# Altium schematic sheet Power.SchDoc
size A4
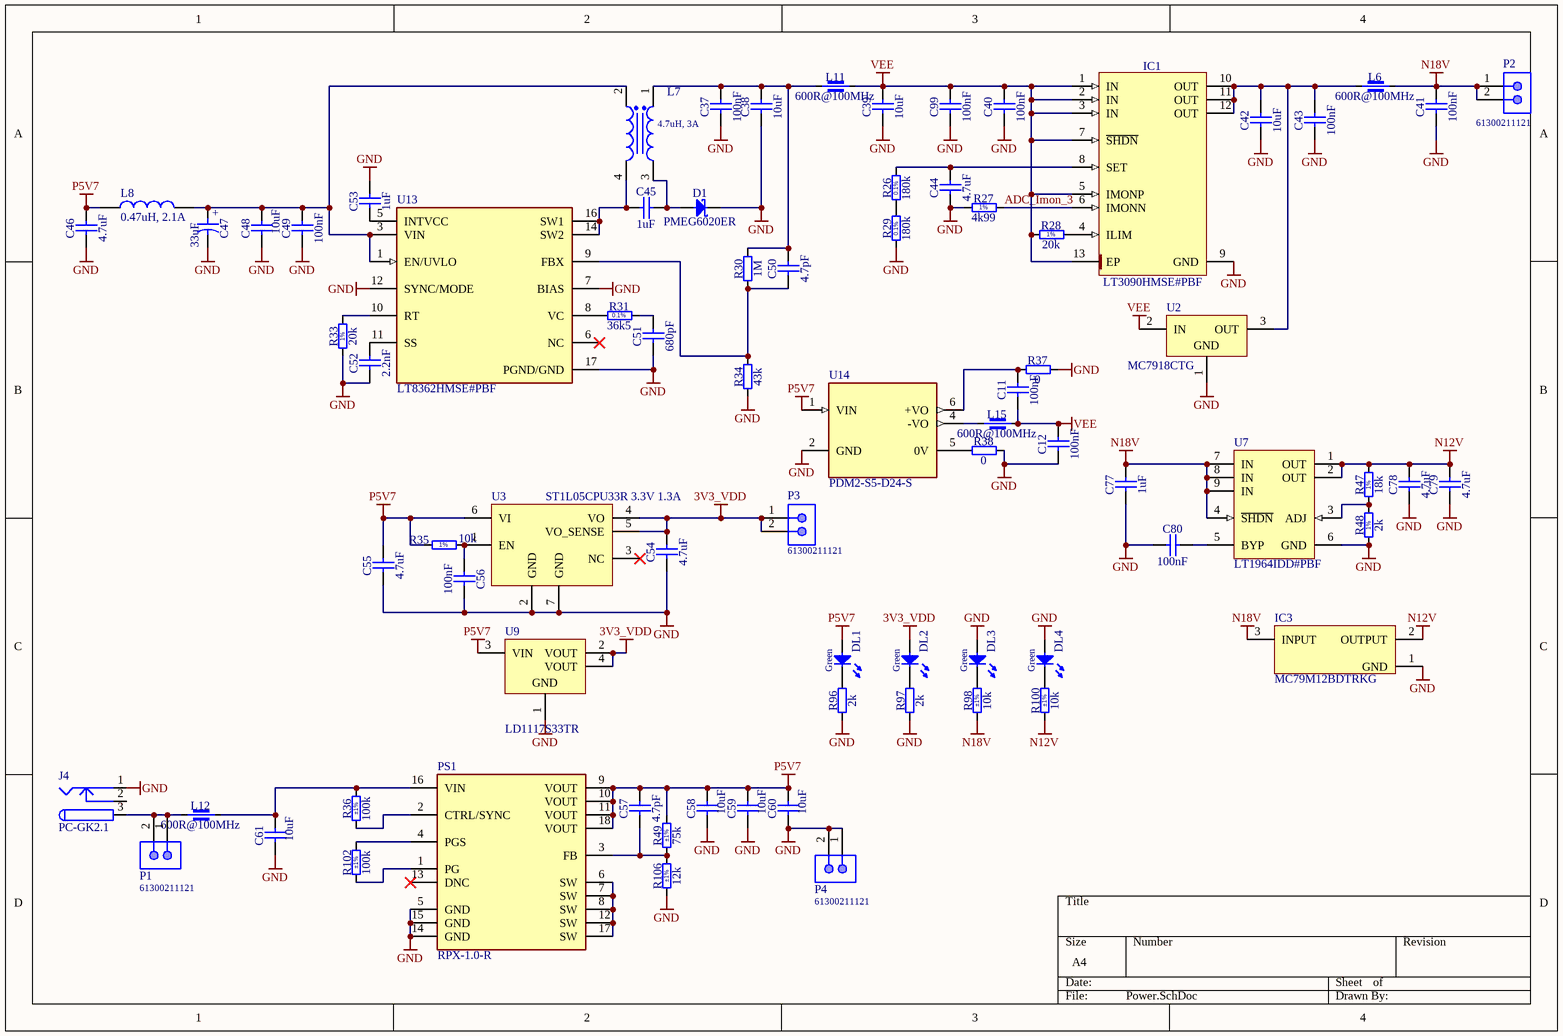
[diagram p0: Power.SchDoc]

## Parts
C11  100nF  [CAPC1005X55N]
C12  100nF  [CAPC1005X55N]
C37  100nF  [CAPC1608X87N]
C38  10uF  [CAPC3216X190N]
C39  10uF  [CAPC3216X190N]
C40  100nF  [CAPC1608X87N]
C41  100nF  [CAPC1608X87N]
C42  10uF  [CAPC3216X190N]
C43  100nF  [CAPC1608X87N]
C44  4.7uF  [CAPC1608X90N]
C45  1uF  [CAPC3216X140N]
C46  4.7uF  [CAPC1608X90N]
C47  33uF  [CAPAE660X540N]
C48  10uF  [CAPC3216X190N]
C49  100nF  [CAPC1608X87N]
C50  4.7pF  [CAPC1005X55N]
C51  680pF  [CAPC1005X55N]
C52  2.2nF  [CAPC1005X55N]
C53  1uF  [CAPC1005X55N]
C54  4.7uF  [CAPC1709X95N]
C55  4.7uF  [CAPC1709X95N]
C56  100nF  [CAPC1005X55N]
C57  4.7pF  [CAPC1005X55N]
C58  10uF  [CAPC3216X190N]
C59  10uF  [CAPC3216X190N]
C60  10uF  [CAPC3216X190N]
C61  10uF  [CAPC3216X190N]
C77  1uF  [CAPC1608X87N]
C78  4.7uF  [CAPC1709X95N]
C79  4.7uF  [CAPC1709X95N]
C80  100nF  [CAPC1005X55N]
C99  100nF  [CAPC1608X87N]
D1  PMEG6020ER  [SODFL3517X110N]
DL1  Green  [LED_OSRAM_LGL29K]
DL2  Green  [LED_OSRAM_LGL29K]
DL3  Green  [LED_OSRAM_LGL29K]
DL4  Green  [LED_OSRAM_LGL29K]
IC1  LT3090HMSE#PBF  [SOP65P490X110-13N-R175X294]
IC3  MC79M12BDTRKG  [TO228P991X239-3N-R546X521]
J4  PC-GK2.1  [DC2020]
L6  600R@100MHz  [INDC2012X110N]
L7  4.7uH, 3A  [WE-DD_1260]
L8  0.47uH, 2.1A  [WE-PMI_0806_H1]
L11  600R@100MHz  [INDC2012X110N]
L12  600R@100MHz  [INDC2012X110N]
L15  600R@100MHz  [INDC2012X110N]
P1  61300211121  [61300211121]
P2  61300211121  [61300211121]
P3  61300211121  [61300211121]
P4  61300211121  [61300211121]
PS1  RPX-1.0-R  [RPX10R]
R26  180k  [RESC3216X65N]
R27  4k99  [RESC1608X55N]
R28  20k  [RESC1005X40N]
R29  180k  [RESC3216X65N]
R30  1M  [RESC1005X40N]
R31  36k5  [RESC1608X55N]
R33  20k  [RESC1005X40N]
R34  43k  [RESC1005X40N]
R35  10k  [RESC1005X40N]
R36  100k  Tolerance: ±1%  [RESC1005X40N]
R37  0  [RESC2012X60N]
R38  0  [RESC2012X60N]
R47  18k  [RESC1005X40N]
R48  2k  [RESC1005X40N]
R49  75k  Tolerance: ±1%  [RESC1005X40N]
R96  2k  [RESC1005X40N]
R97  2k  [RESC1005X40N]
R98  10k  Tolerance: ±1%  [RESC1005X40N]
R100  10k  Tolerance: ±1%  [RESC1005X40N]
R102  100k  Tolerance: ±1%  [RESC1005X40N]
R106  12k  Tolerance: ±1%  [RESC1005X40N]
U2  MC7918CTG  [TO-220]
U3  value ST1L05CPU33R 3.3V 1.3A  [SON95P300X300X80-7N-R160X240]  (hidden comment: ST1L05CPU33R)
U7  LT1964IDD#PBF  [LT-DD-8_V]
U9  LD1117S33TR  [SOT-223_L]
U13  LT8362HMSE#PBF  [FP-MSE-16-05-08-1871-MFG]
U14  PDM2-S5-D24-S  [CONV_PDM2-S5-D24-S]

## Nets
3V3_VDD: C54.2 DL2.2(A) P3.1 P3.2 U3.4(VO) U3.5(VO_SENSE) U9.2(VOUT) U9.4(VOUT)
GND: C12.1 C37.1 C38.1 C39.1 C40.1 C41.1 C42.1 C43.1 C44.1 C46.1 C47.2 C48.1 C49.1 C51.1 C52.1 C53.2 C54.1 C55.1 C56.1 C58.1 C59.1 C60.1 C61.1 C77.1 C78.1 C79.1 C80.1 C99.1 D1.1(C) DL3.2(A) DL4.2(A) IC1.9(GND) IC3.1(GND) J4.1 P4.1 P4.2 PS1.5(GND) PS1.14(GND) PS1.15(GND) R27.1 R29.1 R33.1 R34.1 R37.2 R38.2 R48.1 R96.1 R97.1 R106.1 U2.1(GND) U3.2(GND) U3.7(GND) U7.6(GND) U9.1(GND) U13.7(BIAS) U13.12(SYNC/MODE) U13.17(PGND/GND) U14.2(GND)
N12V: C78.2 C79.2 IC3.2(OUTPUT) R47.2 R100.1 U7.1(OUT) U7.2(OUT)
N18V: C41.2 C77.2 IC3.3(INPUT) L6.2 P2.1 P2.2 R98.1 U7.4(~{SHDN}) U7.7(IN) U7.8(IN) U7.9(IN)
P5V7: C46.2 C55.2 C57.2 C58.2 C59.2 C60.2 DL1.2(A) L8.1 PS1.9(VOUT) PS1.10(VOUT) PS1.11(VOUT) PS1.18(VOUT) R35.1 R49.2 U3.6(VI) U9.3(VIN) U14.1(VIN)
VEE: C11.1 C12.2 C39.2 C40.2 C99.2 IC1.1(IN) IC1.2(IN) IC1.3(IN) IC1.5(IMONP) IC1.7(~{SHDN}) IC1.13(EP) L11.2 L15.2 R28.1 U2.2(IN)
ADC_Imon_3: IC1.6(IMONN) R27.2
NetC11_2: C11.2 R37.1 U14.6(+VO)
NetC37_2: C37.2 C38.2 C50.2 L7.1 L11.1 R30.2
NetC42_2: C42.2 C43.2 IC1.10(OUT) IC1.11(OUT) IC1.12(OUT) L6.1 U2.3(OUT)
NetC44_2: C44.2 IC1.8(SET) R26.2
NetC45_1: C45.1 L7.4 U13.14(SW2) U13.16(SW1)
NetC45_2: C45.2 D1.2(A) L7.3
NetC47_1: C47.1 C48.2 C49.2 L7.2 L8.2 U13.1(EN/UVLO) U13.3(VIN)
NetC50_1: C50.1 R30.1 R34.2 U13.9(FBX)
NetC51_2: C51.2 R31.2
NetC52_2: C52.2 U13.11(SS)
NetC53_1: C53.1 U13.5(INTVCC)
NetC56_2: C56.2 R35.2 U3.1(EN)
NetC57_1: C57.1 PS1.3(FB) R49.1 R106.2
NetC61_2: C61.2 L12.2 PS1.16(VIN) R36.2
NetC80_2: C80.2 U7.5(BYP)
NetDL1_1: DL1.1(C) R96.2
NetDL2_1: DL2.1(C) R97.2
NetDL3_1: DL3.1(C) R98.2
NetDL4_1: DL4.1(C) R100.2
NetIC1_4: IC1.4(ILIM) R28.2
NetJ4_3: J4.3 L12.1 P1.1 P1.2
NetL15_1: L15.1 U14.4(-VO)
NetPS1_1: PS1.1(PG) R102.1
NetPS1_2: PS1.2(CTRL/SYNC) R36.1
NetPS1_4: PS1.4(PGS) R102.2
NetPS1_6: PS1.6(SW) PS1.7(SW) PS1.8(SW) PS1.12(SW) PS1.17(SW)
NetR26_1: R26.1 R29.2
NetR31_1: R31.1 U13.8(VC)
NetR33_2: R33.2 U13.10(RT)
NetR38_1: R38.1 U14.5(0V)
NetR47_1: R47.1 R48.2 U7.3(ADJ)

Not connected (* = marked no-connect by the designer): J4 2; PS1 13(DNC)*; U3 3(NC)*; U13 6(NC)*

## Notes on the sheet
- (in symbol CAE660-540_33UF_35V_20%) +
- (in symbol R0402_2K_1%_0.0625W_100PPM) 1%
- (in symbol R0402_10K_1%_0.0625W_100PPM) 1%
- (in symbol R0402_18K_1%_0.0625W_100PPM) 1%
- (in symbol R0402_20K_1%_0.0625W_100PPM) 1%
- (in symbol R0603_4K99_1%_0.063W_50PPM) 1%
- (in symbol R0603_36K5_0.1%_0.063W_10PPM) 0.1%
- (in symbol R1206_180K_0.1%_0.25W_25PPM) 0.1%

## Library data of the parts
C11 C12 C80 = CC0402_100NF_16V_10%_X7R: Non-polarised capacitor; Part Description: SMD Multilayer Chip Ceramic Capacitor; Manufacturer: GENERIC; Manufacturer1 Part Number: GRM155R71C104KA88D; Voltage: 16V; TC: X7R; Tolerance: ±10%; Part Number: CC0402_100NF_16V_10%_X7R; Component Kind: Standard; Component Type: Standard; Pin Count: 2; Value: 100nF; Status: Not Recommended; Manufacturer Part Number: CC0402_100NF_16V_10%_X7R; Case: 0402; Mounted: Yes; Socket: No; SMD: Yes; Sense: No; Manufacturer1 Example: MURATA; Manufacturer1 ComponentHeight: 0.55mm; HelpURL: \\cern.ch\dfs\Applications\Altium\Datasheets\CC0402_X7R_MURATA_GRM.pdf; Author: CERN DEM JLC; CreateDate: 05.12.2013; LatestRevisionDate: 03.12.2007
C37 C40 C41 C43 C49 C99 = CC0603_100NF_50V_10%_X5R: Non-polarised capacitor; Part Description: SMD Multilayer Chip Ceramic Capacitor; Manufacturer: GENERIC; Manufacturer1 Part Number: C1608X5R1H104K080AA; Voltage: 50V; TC: X5R; Tolerance: ±10%; Part Number: CC0603_100NF_50V_10%_X5R; Component Kind: Standard; Component Type: Standard; Pin Count: 2; Value: 100nF; Status: None; Manufacturer Part Number: CC0603_100NF_50V_10%_X5R; Case: 0603; Mounted: Yes; Socket: No; SMD: Yes; Sense: No; Manufacturer1 Example: TDK; Manufacturer1 ComponentHeight: 0.9mm; HelpURL: \\cern.ch\dfs\Applications\Altium\Datasheets\CC0603_X5R_TDK_C.pdf; Author: CERN DEM MR; CreateDate: 08.01.2016; LatestRevisionDate: 08.01.2016
C38 C39 C42 C48 C58-C61 = CC1206_10UF_35V_10%_X7R_YUDEN_GMJ316BB7106KLHT: Non-polarised capacitor; Part Description: Soft Termination SMD Multilayer Chip Ceramic Capacitor for Automotive / Industrial Applications; Manufacturer: TAIYO YUDEN; Voltage: 35V; TC: X7R; Tolerance: ±10%; Part Number: CC1206_10UF_35V_10%_X7R_YUDEN_GMJ316BB7106KLHT; Component Kind: Standard; Component Type: Standard; Pin Count: 2; Value: 10uF; Status: Not Recommended; Manufacturer Part Number: GMJ316BB7106KLHT; Case: 1206; Mounted: Yes; Socket: No; SMD: Yes; Sense: No; ComponentHeight: 1.90mm; HelpURL: \\cern.ch\dfs\Applications\Altium\Datasheets\CC1206_TAIYO-YUDEN_GMJ316BB7106KLHT.pdf; Author: CERN DEM BC; CreateDate: 26.02.2016; LatestRevisionDate: 17.12.2018
C44 C46 = CC0603_4.7UF_25V_10%_X5R: Non-polarised capacitor; Part Description: SMD Multilayer Chip Ceramic Capacitor; Manufacturer: GENERIC; Manufacturer1 Part Number: GRM188R61E475KE11D; Voltage: 25V; TC: X5R; Tolerance: ±10%; Part Number: CC0603_4.7UF_25V_10%_X5R; Component Kind: Standard; Component Type: Standard; Pin Count: 2; Value: 4.7uF; Status: None; Manufacturer Part Number: CC0603_4.7UF_25V_10%_X5R; Case: 0603; Mounted: Yes; Socket: No; SMD: Yes; Sense: No; Manufacturer1 Example: MURATA; Manufacturer1 ComponentHeight: 0.95mm; HelpURL: \\cern.ch\dfs\Applications\Altium\Datasheets\CC0603_MURATA_GRM188R61E475KE11D.pdf; Author: CERN DEM JLC; CreateDate: 10.11.2014; LatestRevisionDate: 10.11.2014
C45 = CC1206_1UF_100V_10%_X7R: Non-polarised capacitor; Part Description: SMD Multilayer Chip Ceramic Capacitor; Manufacturer: GENERIC; Manufacturer1 Part Number: C1206C105K1RACTU; Voltage: 100V; TC: X7R; Tolerance: ±10%; Part Number: CC1206_1UF_100V_10%_X7R; Component Kind: Standard; Component Type: Standard; Pin Count: 2; Value: 1uF; Status: Preferred; Manufacturer Part Number: CC1206_1UF_100V_10%_X7R; Case: 1206; Mounted: Yes; Socket: No; SMD: Yes; Sense: No; Manufacturer1 Example: KEMET; Manufacturer1 ComponentHeight: 1.8mm; HelpURL: \\cern.ch\dfs\Applications\Altium\Datasheets\CC1206_X7R_KEMET_OPENMODE.pdf; Author: CERN DEM BC; CreateDate: 24.01.2020; LatestRevisionDate: 24.01.2020
C47 = CAE660-540_33UF_35V_20%: Polarised capacitor; Part Description: Aluminum Electrolytic SMT Capacitor; Manufacturer: PANASONIC; Manufacturer Part Number: EEEFK1V330AP; Voltage: 35V; Tolerance: ±20%; Part Number: CAE660-540_33UF_35V_20%; Component Kind: Standard; Component Type: Standard; Pin Count: 2; Value: 33uF; Status: Not Recommended; Case: D; Mounted: Yes; Socket: No; SMD: Yes; Sense: No; ComponentHeight: 5.8mm; HelpURL: \\cern.ch\dfs\Applications\Altium\Datasheets\CAE_PANASONIC_FK.pdf; Author: CERN DEM JLC; CreateDate: 03.12.2007; LatestRevisionDate: 05.11.2014
C50 C57 = CC0402_4.7PF_50V_0.25PF_C0G: Non-polarised capacitor; Part Description: SMD Multilayer Chip Ceramic Capacitor; Manufacturer: GENERIC; Manufacturer1 Part Number: C0402C479C5GACTU; Voltage: 50V; TC: C0G/NP0; Tolerance: ±0.25pF; Part Number: CC0402_4.7PF_50V_0.25PF_C0G; Component Kind: Standard; Component Type: Standard; Pin Count: 2; Value: 4.7pF; Status: Preferred; Manufacturer Part Number: CC0402_4.7PF_50V_0.25PF_C0G; Case: 0402; Mounted: Yes; Socket: No; SMD: Yes; Sense: No; Manufacturer1 Example: KEMET; Manufacturer1 ComponentHeight: 0.55mm; HelpURL: \\cern.ch\dfs\Applications\Altium\Datasheets\CC0402_C0G_KEMET_(Commercial Grade).pdf; Author: CERN DEM JLC; CreateDate: 03.12.2007; LatestRevisionDate: 22.04.2015
C51 = CC0402_680PF_50V_5%_X7R: Non-polarised capacitor; Part Description: SMD Multilayer Chip Ceramic Capacitor; Manufacturer: GENERIC; Manufacturer Part Number: CC0402_680PF_50V_10%_X7R; Manufacturer1 Part Number: 223858715621; Voltage: 50V; TC: X7R; Tolerance: ±10%; Part Number: CC0402_680PF_50V_5%_X7R; Component Kind: Standard; Component Type: Standard; Pin Count: 2; Value: 680pF; Status: Not Recommended; Case: 0402; Mounted: Yes; Socket: No; SMD: Yes; Sense: No; Manufacturer1 Example: PHYCOMP; Manufacturer1 ComponentHeight: 0.55mm; HelpURL: \\cern.ch\dfs\Applications\Altium\Datasheets\CC0402_NP0_PHYCOMP.pdf; Author: CERN DEM JLC; CreateDate: 03.12.2007; LatestRevisionDate: 03.12.2007
C52 = CC0402_2.2NF_50V_10%_X7R: Non-polarised capacitor; Part Description: SMD Multilayer Chip Ceramic Capacitor; Manufacturer: GENERIC; Manufacturer1 Part Number: 223858715627; Voltage: 50V; TC: X7R; Tolerance: ±10%; Part Number: CC0402_2.2NF_50V_10%_X7R; Component Kind: Standard; Component Type: Standard; Pin Count: 2; Value: 2.2nF; Status: Not Recommended; Manufacturer Part Number: CC0402_2.2NF_50V_10%_X7R; Case: 0402; Mounted: Yes; Socket: No; SMD: Yes; Sense: No; Manufacturer1 Example: PHYCOMP; Manufacturer1 ComponentHeight: 0.55mm; HelpURL: \\cern.ch\dfs\Applications\Altium\Datasheets\CC0402_X7R_PHYCOMP.pdf; Author: CERN DEM JLC; CreateDate: 03.12.2007; LatestRevisionDate: 03.12.2007
C53 = CC0402_1UF_16V_10%_X5R: Non-polarised capacitor; Part Description: SMD Multilayer Chip Ceramic Capacitor; Manufacturer: GENERIC; Manufacturer1 Part Number: C1005X5R1C105KT; Voltage: 16V; TC: X5R; Tolerance: ±10%; Part Number: CC0402_1UF_16V_10%_X5R; Component Kind: Standard; Component Type: Standard; Pin Count: 2; Value: 1uF; Status: Preferred; Manufacturer Part Number: CC0402_1UF_16V_10%_X5R; Case: 0402; Mounted: Yes; Socket: No; SMD: Yes; Sense: No; Manufacturer1 Example: TDK; Manufacturer1 ComponentHeight: 0.55mm; HelpURL: \\cern.ch\dfs\Applications\Altium\Datasheets\CC0402_X5R_TDK_C.pdf; Author: CERN DEM JLC; CreateDate: 25.10.2012; LatestRevisionDate: 25.10.2012
C54 C55 C78 C79 = CC0603_4.7UF_16V_10%_X5R: Non-polarised capacitor; Part Description: SMD Multilayer Chip Ceramic Capacitor; Manufacturer: GENERIC; Manufacturer1 Part Number: EMK107ABJ475KA-T; Voltage: 16V; TC: X5R; Tolerance: ±10%; Part Number: CC0603_4.7UF_16V_10%_X5R; Component Kind: Standard; Component Type: Standard; Pin Count: 2; Value: 4.7uF; Status: None; Manufacturer Part Number: CC0603_4.7UF_16V_10%_X5R; Case: 0603; Mounted: Yes; Socket: No; SMD: Yes; Sense: No; Manufacturer1 Example: TAIYO YUDEN; Manufacturer1 ComponentHeight: 0.95mm; HelpURL: \\cern.ch\dfs\Applications\Altium\Datasheets\CC0603_X7R_TAIYO-YUDEN_HIGH-VALUE.pdf; Author: CERN DEM JLC; CreateDate: 16.12.2013; LatestRevisionDate: 16.09.2014
C56 = CC0402_100NF_16V_10%_X5R: Non-polarised capacitor; Part Description: SMD Multilayer Chip Ceramic Capacitor; Manufacturer: GENERIC; Manufacturer1 Part Number: GRM155R61C104KA88D; Voltage: 16V; TC: X5R; Tolerance: ±10%; Part Number: CC0402_100NF_16V_10%_X5R; Component Kind: Standard; Component Type: Standard; Pin Count: 2; Value: 100nF; Status: None; Manufacturer Part Number: CC0402_100NF_16V_10%_X5R; Case: 0402; Mounted: Yes; Socket: No; SMD: Yes; Sense: No; Manufacturer1 Example: MURATA; Manufacturer1 ComponentHeight: 0.55mm; HelpURL: \\cern.ch\dfs\Applications\Altium\Datasheets\CC0402_X5R_MURATA_GRM.pdf; Author: CERN DEM JLC; CreateDate: 10.12.2013; LatestRevisionDate: 10.12.2013
C77 = CC0603_1UF_25V_10%_X7R: Non-polarised capacitor; Part Description: SMD Multilayer Chip Ceramic Capacitor; Manufacturer: GENERIC; Manufacturer1 Part Number: GRM188R71E105KA12D; Voltage: 25V; TC: X7R; Tolerance: ±10%; Part Number: CC0603_1UF_25V_10%_X7R; Component Kind: Standard; Component Type: Standard; Pin Count: 2; Value: 1uF; Status: None; Manufacturer Part Number: CC0603_1UF_25V_10%_X7R; Case: 0603; Mounted: Yes; Socket: No; SMD: Yes; Sense: No; Manufacturer1 Example: MURATA; Manufacturer1 ComponentHeight: 0.9mm; HelpURL: \\cern.ch\dfs\Applications\Altium\Datasheets\CC0603_X7R_MURATA.pdf; Author: CERN DEM JLC; CreateDate: 18.01.2011; LatestRevisionDate: 18.01.2011
D1 = PMEG6020ER: Schottky Diode; Part Description: MEGA Schottky Barrier Rectifier; Manufacturer: NXP SEMICONDUCTORS; Voltage: 60V; Power: 2A; PressFit: No; Bonding: No; Part Number: PMEG6020ER; Component Kind: Standard; Component Type: Standard; Device: PMEG6020ER; PackageDescription: SODFL Diode (SOD123W); 2.60mm W X 1.70mm L X 1.10mm H body, IPC Medium Density; Manufacturer Part Number: PMEG6020ER; Pin Count: 2; Case: SOD123; Mounted: Yes; Socket: No; SMD: Yes; Sense: No; ComponentHeight: 0.65mm; HelpURL: \\cern.ch\dfs\Applications\Altium\Datasheets\PMEG6020ER.pdf; Author: CERN DEM JMW; CreateDate: 19.06.2014; LatestRevisionDate: 19.06.2014
DL1-DL4 = LED_OSRAM_LG L29K-G2J1-24-Z: LED Green 1C 2A; Part Description: Surface Mount Green LED (0603 Case); Manufacturer: OSRAM; PressFit: No; Bonding: No; Status Comment: Sourcing Difficulty; Part Number: LED_OSRAM_LG L29K-G2J1-24-Z; Component Kind: Standard; Component Type: Standard; Color: Green; PackageDescription: Green Chip LED, 2-Leads, Body 1.7x0.8mm, IPC Medium Density; Manufacturer Part Number: LG L29K-G2J1-24-Z; Pin Count: 2; Case: 0603; Mounted: Yes; Socket: No; SMD: Yes; Sense: No; ComponentHeight: 0.67mm; HelpURL: \\cern.ch\dfs\Applications\Altium\Datasheets\LED_OSRAM_LGL29K.pdf; Author: CERN DEM JLC; CreateDate: 24.04.2012; LatestRevisionDate: 24.04.2012; Status: Not Recommended
IC1 = LT3090HMSE#PBF: –36V, 600mA Negative Linear Regulator with Programmable Current Limit; Manufacturer: LINEAR TECHNOLOGY; PressFit: No; Bonding: No; Part Number: LT3090HMSE#PBF; Component Kind: Standard; Component Type: Standard; Device: LT3090HMSE#PBF; PackageDescription: SOP,0.65mm pitch;12 pin,3.00mm W X 4.039mm L X 1.10mm H body, (w/thermal tab 1.75 X 2.94 mm), IPC Medium Density; Part Description: –36V, 600mA Negative Linear Regulator with Programmable Current Limit; Manufacturer Part Number: LT3090HMSE#PBF; Pin Count: 13; Case: MSOP12; Mounted: Yes; Socket: No; SMD: Yes; Sense: No; ComponentHeight: 1.1mm; HelpURL: \\cern.ch\dfs\Applications\Altium\Datasheets\LT3090HMSE#PBF.pdf; Author: CERN DEM JLC; CreateDate: 2015-01-12; LatestRevisionDate: 2015-01-12
J4 = CON_DC_JACK_TH: Low Voltage Power Supply Connector (maritex); Published: 17-Dec-2003; Datasheet: Latest Revision: 09-May-2002; Publisher: Altium Limited; Supplier 1: TME; Supplier Part Number 1: PC-GK2.1
L6 L11 L12 L15 = IND0805_WURTH_742792040: Part Description: SMD EMI Suppression Chip Ferrite Bead (WE-CBF Series); Manufacturer: WURTH ELEKTRONIK; Power: 2A; Resistance: 0.150R; Tolerance: ±25%; Part Number: IND0805_WURTH_742792040; Component Kind: Standard; Component Type: Standard; Pin Count: 2; Value: 600R@100MHz; Status: None; Manufacturer Part Number: 742792040; Case: 0805; Mounted: Yes; Socket: No; SMD: Yes; Sense: No; ComponentHeight: 1.1mm; HelpURL: \\cern.ch\dfs\Applications\Altium\Datasheets\IND0805_WURTH_742792040.pdf; Author: CERN DEM JLC; CreateDate: 10.05.2010; LatestRevisionDate: 25.10.2018
L7 = 744871004: WE-DD SMT Shielded Coupled Inductor, size 1260, 4.7uH, 3A; Manufacturer: Wurth Elektronik; Rated Voltage: 80V; DC Resistance max.: 28mOhm; Self Resonant Frequency: 20MHz; DC Resistance typ.: 23mOhm; Saturation Current: 8A; Turns Ratio: 1:1; Type: Crossed; ComponentLink1Description: Manufacturer; ComponentLink1URL: http://www.we-online.de; ComponentLink2Description: Datasheet; ComponentLink2URL: https://www.we-online.com/catalog/datasheet/744871004.pdf; Packaging: Tape and Reel; Published Date: April 2020; Rated Current: 3A; Operating Temperature: -40 to +125degC; Size: 1260; Inductance: 4.7uH; Mounting Technology: SMT; Manufacturer Part Number: 744871004
L8 = 74479876147: WE-PMI Power Multilayer Inductor, size 0806, 0.47uH, 2.1A; Manufacturer: Wurth Elektronik; Q-Factor: 13; Saturation Current: 2A; DC Resistance max.: 50mOhm; Inductance Tolerance: +/-20%; Rated Current @20K: 1.5A; Self Resonant Frequency: 120MHz; Type: Low RDC & High Saturation Current; ComponentLink1Description: Manufacturer; ComponentLink1URL: http://www.we-online.de; ComponentLink2Description: Datasheet; ComponentLink2URL: https://www.we-online.com/catalog/datasheet/74479876147.pdf; Mounting Technology: SMT; Operating Temperature: -40 to +125degC; Packaging: Tape and Reel; Inductance: 0.47uH; Rated Current @40K: 2.1A; Manufacturer Part Number: 74479876147; Published Date: April 2020; Size: 0806
P1-P4 = 61300211121: WR-PHD Pin Header, THT, pitch 2.54mm, Single Row, Vertical, 2p; Manufacturer: Wurth Elektronik; Pin Number: 2; Rated Current: 3A; Working Voltage: 250VAC; Withstanding Voltage: 500VAC; Contact Resistance: 20mOhm; ComponentLink1Description: Manufacturer; ComponentLink1URL: http://www.we-online.de; ComponentLink2Description: Datasheet; ComponentLink2URL: https://www.we-online.com/catalog/datasheet/61300211121.pdf; Manufacturer Part Number: 61300211121; Published Date: May 2020; Pitch: 2.54mm; Operating Temperature: -40 to +105degC; Mounting Technology: THT; Packaging: Bag; Gender: Pin Header; Row Number: Single; Orientation: Vertical
PS1 = RPX-1.0-R: Power Supply; Manufacturer_Name: RECOM Power; Datasheet Link: https://recom-power.com/pdf/Innoline/RPX-1.0.pdf; Height: 1.6mm; Manufacturer_Part_Number: RPX-1.0-R
R26 R29 = R1206_180K_0.1%_0.25W_25PPM: Resistor - 0.1%; Part Description: Thin Film Chip Resistor; Manufacturer: GENERIC; Manufacturer1 Part Number: RN73H2BTTD1803B25; Power: 0.25W; TC: ±25ppm/°C; PressFit: No; Part Number: R1206_180K_0.1%_0.25W_25PPM; Component Kind: Standard; Component Type: Standard; Pin Count: 2; Value: 180k; Status: Not Recommended; Tolerance: ±0.1%; Manufacturer Part Number: R1206_180K_0.1%_0.25W_25PPM; Case: 1206; Mounted: Yes; Sense: No; Socket: No; SMD: Yes; Manufacturer1 Example: KOA; Manufacturer1 ComponentHeight: 0.70mm; HelpURL: \\cern.ch\dfs\Applications\Altium\Datasheets\R1206_KOA_RN73H.pdf; Author: CERN DEM JLC; CreateDate: 03.12.2007; LatestRevisionDate: 13.03.2008
R27 = R0603_4K99_1%_0.063W_50PPM: Resistor - 1%; Part Description: General Purpose Thick Film Chip Resistor; Manufacturer: GENERIC; Manufacturer1 Part Number: CPF0603F4K99C1; Power: 0.063W; TC: ±50ppm/°C; PressFit: No; Part Number: R0603_4K99_1%_0.063W_50PPM; Component Kind: Standard; Component Type: Standard; Pin Count: 2; Value: 4k99; Status: None; Tolerance: ±1%; Manufacturer Part Number: R0603_4K99_1%_0.063W_50PPM; Case: 0603; Mounted: Yes; Sense: No; Socket: No; SMD: Yes; Manufacturer1 Example: TYCO NEOHM; Manufacturer1 ComponentHeight: 0.55mm; HelpURL: \\cern.ch\dfs\Applications\Altium\Datasheets\R0603_TYCO_CPF.pdf; Author: CERN DEM JLC; CreateDate: 2010-05-20; LatestRevisionDate: 2010-05-20
R28 R33 = R0402_20K_1%_0.0625W_100PPM: Resistor - 1%; Part Description: General Purpose Thick Film Chip Resistor; Manufacturer: GENERIC; Manufacturer1 Part Number: 232270672003L; TC: ±100ppm/°C; PressFit: No; Part Number: R0402_20K_1%_0.0625W_100PPM; Component Kind: Standard; Component Type: Standard; Pin Count: 2; Value: 20k; Status: Not Recommended; Power: 0.0625W; Tolerance: ±1%; Manufacturer Part Number: R0402_20K_1%_0.0625W_100PPM; Case: 0402; Mounted: Yes; Sense: No; Socket: No; SMD: Yes; Manufacturer1 Example: YAGEO PHYCOMP; Manufacturer1 ComponentHeight: 0.4mm; HelpURL: \\cern.ch\dfs\Applications\Altium\Datasheets\R0402_Phycomp_RC0402.pdf; Author: CERN DEM JLC
  R28: CreateDate: 2007-12-03; LatestRevisionDate: 2012-10-17
  R33: CreateDate: 03.12.2007; LatestRevisionDate: 17.10.2012
R30 = R0402_1M_1%_0.0625W_100PPM: Resistor - 1%; Part Description: General Purpose Thick Film Chip Resistor; Manufacturer: GENERIC; Manufacturer1 Part Number: 232270671005L; TC: ±100ppm/°C; PressFit: No; Part Number: R0402_1M_1%_0.0625W_100PPM; Component Kind: Standard; Component Type: Standard; Pin Count: 2; Value: 1M; Status: Not Recommended; Power: 0.0625W; Tolerance: ±1%; Manufacturer Part Number: R0402_1M_1%_0.0625W_100PPM; Case: 0402; Mounted: Yes; Sense: No; Socket: No; SMD: Yes; Manufacturer1 Example: YAGEO PHYCOMP; Manufacturer1 ComponentHeight: 0.4mm; HelpURL: \\cern.ch\dfs\Applications\Altium\Datasheets\R0402_Phycomp_RC0402.pdf; Author: CERN DEM JLC; CreateDate: 03.12.2007; LatestRevisionDate: 17.10.2012
R31 = R0603_36K5_0.1%_0.063W_10PPM: Resistor - 0.1%; Part Description: Thin Film Chip Resistor; Manufacturer: GENERIC; Manufacturer1 Part Number: RN73C1J36K5BTDF; Power: 0.063W; TC: ±10ppm; PressFit: No; Part Number: R0603_36K5_0.1%_0.063W_10PPM; Component Kind: Standard; Component Type: Standard; Pin Count: 2; Value: 36k5; Status: Not Recommended; Tolerance: ±0.1%; Manufacturer Part Number: R0603_36K5_0.1%_0.063W_10PPM; Case: 0603; Mounted: Yes; Sense: No; Socket: No; SMD: Yes; Manufacturer1 Example: TYCO HOLSWORTHY; Manufacturer1 ComponentHeight: 0.5mm; HelpURL: \\cern.ch\dfs\Applications\Altium\Datasheets\R0603_Tyco_RN73.pdf; Author: CERN DEM JLC; CreateDate: 03.12.2007; LatestRevisionDate: 13.03.2008
R34 = R0402_43K_1%_0.0625W_100PPM: Resistor - 1%; Part Description: General Purpose Thick Film Chip Resistor; Manufacturer: GENERIC; Manufacturer1 Part Number: 232270674303L; TC: ±100ppm/°C; PressFit: No; Part Number: R0402_43K_1%_0.0625W_100PPM; Component Kind: Standard; Component Type: Standard; Pin Count: 2; Value: 43k; Status: Not Recommended; Power: 0.0625W; Tolerance: ±1%; Manufacturer Part Number: R0402_43K_1%_0.0625W_100PPM; Case: 0402; Mounted: Yes; Sense: No; Socket: No; SMD: Yes; Manufacturer1 Example: YAGEO PHYCOMP; Manufacturer1 ComponentHeight: 0.4mm; HelpURL: \\cern.ch\dfs\Applications\Altium\Datasheets\R0402_Phycomp_RC0402.pdf; Author: CERN DEM JLC; CreateDate: 03.12.2007; LatestRevisionDate: 17.10.2012
R35 R98 R100 = R0402_10K_1%_0.0625W_100PPM: Resistor - 1%; Part Description: General Purpose Thick Film Chip Resistor; Manufacturer: GENERIC; Manufacturer1 Part Number: 232270671003L; TC: ±100ppm/°C; PressFit: No; Part Number: R0402_10K_1%_0.0625W_100PPM; Component Kind: Standard; Component Type: Standard; Pin Count: 2; Value: 10k; Status: Not Recommended; Power: 0.0625W; Manufacturer Part Number: R0402_10K_1%_0.0625W_100PPM; Case: 0402; Mounted: Yes; Sense: No; Socket: No; SMD: Yes; Manufacturer1 Example: YAGEO PHYCOMP; Manufacturer1 ComponentHeight: 0.4mm; HelpURL: \\cern.ch\dfs\Applications\Altium\Datasheets\R0402_Phycomp_RC0402.pdf; Author: CERN DEM JLC; CreateDate: 03.12.2007; LatestRevisionDate: 17.10.2012
  R35: Tolerance: ±1%
R36 R102 = R0402_100K_1%_0.0625W_100PPM: Resistor - 1%; Part Description: General Purpose Thick Film Chip Resistor; Manufacturer: GENERIC; Manufacturer1 Part Number: 232270671004L; TC: ±100ppm/°C; PressFit: No; Part Number: R0402_100K_1%_0.0625W_100PPM; Component Kind: Standard; Component Type: Standard; Pin Count: 2; Value: 100k; Status: Not Recommended; Power: 0.0625W; Manufacturer Part Number: R0402_100K_1%_0.0625W_100PPM; Case: 0402; Mounted: Yes; Sense: No; Socket: No; SMD: Yes; Manufacturer1 Example: YAGEO PHYCOMP; Manufacturer1 ComponentHeight: 0.4mm; HelpURL: \\cern.ch\dfs\Applications\Altium\Datasheets\R0402_Phycomp_RC0402.pdf; Author: CERN DEM JLC; CreateDate: 03.12.2007; LatestRevisionDate: 17.10.2012
R37 R38 = R0805_0R_JUMPER: Resistor; Part Description: 2A (0.05R Max DC Resistance) Zero Ohm Jumper; Manufacturer: GENERIC; Manufacturer1 Part Number: NRC10Z0; PressFit: No; Part Number: R0805_0R_JUMPER; Component Kind: Standard; Component Type: Standard; Pin Count: 2; Value: 0; Status: Preferred; Manufacturer Part Number: R0805_0R_JUMPER; Case: 0805; Mounted: Yes; Sense: No; Socket: No; SMD: Yes; Manufacturer1 Example: NIC COMPONENT; Manufacturer1 ComponentHeight: 0.6mm; HelpURL: \\cern.ch\dfs\Applications\Altium\Datasheets\R0805_NIC_NRC.pdf; Author: CERN DEM JLC; CreateDate: 03.12.2007; LatestRevisionDate: 13.03.2008
R47 = R0402_18K_1%_0.0625W_100PPM: Resistor - 1%; Part Description: General Purpose Thick Film Chip Resistor; Manufacturer: GENERIC; Manufacturer1 Part Number: 232270671803L; TC: ±100ppm/°C; PressFit: No; Part Number: R0402_18K_1%_0.0625W_100PPM; Component Kind: Standard; Component Type: Standard; Pin Count: 2; Value: 18k; Status: Not Recommended; Power: 0.0625W; Tolerance: ±1%; Manufacturer Part Number: R0402_18K_1%_0.0625W_100PPM; Case: 0402; Mounted: Yes; Sense: No; Socket: No; SMD: Yes; Manufacturer1 Example: YAGEO PHYCOMP; Manufacturer1 ComponentHeight: 0.4mm; HelpURL: \\cern.ch\dfs\Applications\Altium\Datasheets\R0402_Phycomp_RC0402.pdf; Author: CERN DEM JLC; CreateDate: 03.12.2007; LatestRevisionDate: 17.10.2012
R48 R96 R97 = R0402_2K_1%_0.0625W_100PPM: Resistor - 1%; Part Description: General Purpose Thick Film Chip Resistor; Manufacturer: GENERIC; Manufacturer1 Part Number: 232270672002L; TC: ±100ppm/°C; PressFit: No; Part Number: R0402_2K_1%_0.0625W_100PPM; Component Kind: Standard; Component Type: Standard; Pin Count: 2; Value: 2k; Status: Not Recommended; Power: 0.0625W; Tolerance: ±1%; Manufacturer Part Number: R0402_2K_1%_0.0625W_100PPM; Case: 0402; Mounted: Yes; Sense: No; Socket: No; SMD: Yes; Manufacturer1 Example: YAGEO PHYCOMP; Manufacturer1 ComponentHeight: 0.4mm; HelpURL: \\cern.ch\dfs\Applications\Altium\Datasheets\R0402_Phycomp_RC0402.pdf; Author: CERN DEM JLC; CreateDate: 03.12.2007; LatestRevisionDate: 17.10.2012
R49 = R0402_75K_1%_0.0625W_100PPM: Resistor - 1%; Part Description: General Purpose Thick Film Chip Resistor; Manufacturer: GENERIC; Manufacturer1 Part Number: 232270677503L; TC: ±100ppm/°C; PressFit: No; Part Number: R0402_75K_1%_0.0625W_100PPM; Component Kind: Standard; Component Type: Standard; Pin Count: 2; Value: 75k; Status: Not Recommended; Power: 0.0625W; Manufacturer Part Number: R0402_75K_1%_0.0625W_100PPM; Case: 0402; Mounted: Yes; Sense: No; Socket: No; SMD: Yes; Manufacturer1 Example: YAGEO PHYCOMP; Manufacturer1 ComponentHeight: 0.4mm; HelpURL: \\cern.ch\dfs\Applications\Altium\Datasheets\R0402_Phycomp_RC0402.pdf; Author: CERN DEM JLC; CreateDate: 03.12.2007; LatestRevisionDate: 17.10.2012
R106 = R0402_12K_1%_0.0625W_100PPM: Resistor - 1%; Part Description: General Purpose Thick Film Chip Resistor; Manufacturer: GENERIC; Manufacturer1 Part Number: 232270671203L; TC: ±100ppm/°C; PressFit: No; Part Number: R0402_12K_1%_0.0625W_100PPM; Component Kind: Standard; Component Type: Standard; Pin Count: 2; Value: 12k; Status: Not Recommended; Power: 0.0625W; Manufacturer Part Number: R0402_12K_1%_0.0625W_100PPM; Case: 0402; Mounted: Yes; Sense: No; Socket: No; SMD: Yes; Manufacturer1 Example: YAGEO PHYCOMP; Manufacturer1 ComponentHeight: 0.4mm; HelpURL: \\cern.ch\dfs\Applications\Altium\Datasheets\R0402_Phycomp_RC0402.pdf; Author: CERN DEM JLC; CreateDate: 03.12.2007; LatestRevisionDate: 17.10.2012
U2 = CMP-0244-00473-1: Negative Voltage Regulator, -15V, 3-Pin D2PAK; PackageVersion: 2011; PackageReference: TO-220; DatasheetVersion: 1/11/2011; ComponentLink1Description: Manufacturer URL; PackageDescription: TO, Thru-Hole, Vertical, Heatsink Mounted; 3 In-Line Leads; Pitch 2.54 mm; ComponentLink1URL: http://www.st.com; ComponentLink2Description: Datasheet; ComponentLink2URL: http://www.st.com/internet/com/TECHNICAL_RESOURCES/TECHNICAL_LITERATURE/DATASHEET/CD00000450.pdf
U3 = MCD-01025: LDO, 3.3V, 1.3A, Very low quiescent current BiCMOS voltage regulator; Part_Type: IC; Manufacturer: STMICROELECTRONICS; BMS_Part_Number: 9176246; Provided_By: SUBCO with ST control; ECCN_US: EAR99; ECCN_EU: NEC; Internal_Part_Number: MCD-01025; Status: Released; Manufacturer_Part_Number: ST1L05CPU33R; Package: DFN6-3x3; ComponentLink1Description: Datasheet; ComponentLink1URL: http://tunmcdsvn.tun.st.com/Component_Datasheet_Library/Trunk/IC/STM_LDO_ST1L05CPU33R
U7 = CMP-0476-00220-1: 200 mA, Low Noise, Low Dropout Negative Micropower Regulator, -1.9 to -20 V Vin, Adjustable Vout, 8-pin SON (DD-8), -40 to 125 degC, Pb-Free; Manufacturer: Linear Technology; Discrete Pass Element: no; Number of Outputs: 1; PSRR(dB): 54; Iout(mA): 200; Output Voltage: Adj; Noise(uV): 30; Dropout Voltage(V): 0.34; Shutdown Current(uA): 3; Isupply(mA): 0.03; DatasheetVersion: Rev. B; Code_JEDEC: MO-229; PackageDescription: 8-Pin Plastic DFN, Body 3 x 3 mm, Pitch 0.5 mm; Vin Min(V): -20; ComponentLink1URL: http://www.linear.com/; PackageReference: DD-8; ComponentLink3URL: http://cds.linear.com/docs/en/packaging/DFN_8_05-08-1698.pdf; ComponentLink1Description: Manufacturer URL; Vin Max(V): -1.9; Mounting Technology: Surface Mount; ComponentLink3Description: Package Specification; RoHS: TRUE; ComponentLink2Description: Datasheet; PackageVersion: Jun-10; PartNumber: LT1964IDD#PBF; ComponentLink2URL: http://cds.linear.com/docs/en/datasheet/1964fb.pdf
U9 = CMP-0244-00310-1: Fixed Low Drop Positive Voltage Regulator, 3.3V, 4-Pin SOT-223, Tape and Reel; ComponentLink2Description: Datasheet; PackageDescription: 4-Pin SOT-223 Package, 6.5 x 3.5 mm Body, 2.3 mm Pitch, 7 mm Lead Span; PackageVersion: 2010; ComponentLink2URL: http://www.st.com/internet/com/TECHNICAL_RESOURCES/TECHNICAL_LITERATURE/DATASHEET/CD00000544.pdf; PackageReference: SOT-223; DatasheetVersion: 1/11/2011; ComponentLink1Description: Manufacturer URL; ComponentLink1URL: http://www.st.com
U13 = CMP-09139-000272-1: IC REG BST SEPIC 2A 16MSOP; RoHS Compliant: Yes
U14 = PDM2-S5-D24-S: 2 W, 1:1 Input Range, Single/Dual Unregulated Output, 6 Pin SIP, 1500 Vdc Isolation, High Temp Range, Dc-Dc Converter; MF: CUI Inc.; Digi-Key_Part_Number: 102-3005-5-ND; Purchase-URL: https://pricing.snapeda.com/search/part/PDM2-S5-D24-S/?ref=eda; MP: PDM2-S5-D24-S; CUI_purchase_URL: https://www.cui.com/product/dc-dc-converters/isolated/pdm2-s-series?utm_source=snapeda.com&utm_medium=referral&utm_campaign=snapedaBOM; SnapEDA_Link: https://www.snapeda.com/parts/PDM2-S5-D24-S/CUI/view-part/?ref=snap; Value: *; Package: SIP-6 CUI; Check_prices: https://www.snapeda.com/parts/PDM2-S5-D24-S/CUI/view-part/?ref=eda